# Altium project Bluetooth_Sentinel.PrjPcb
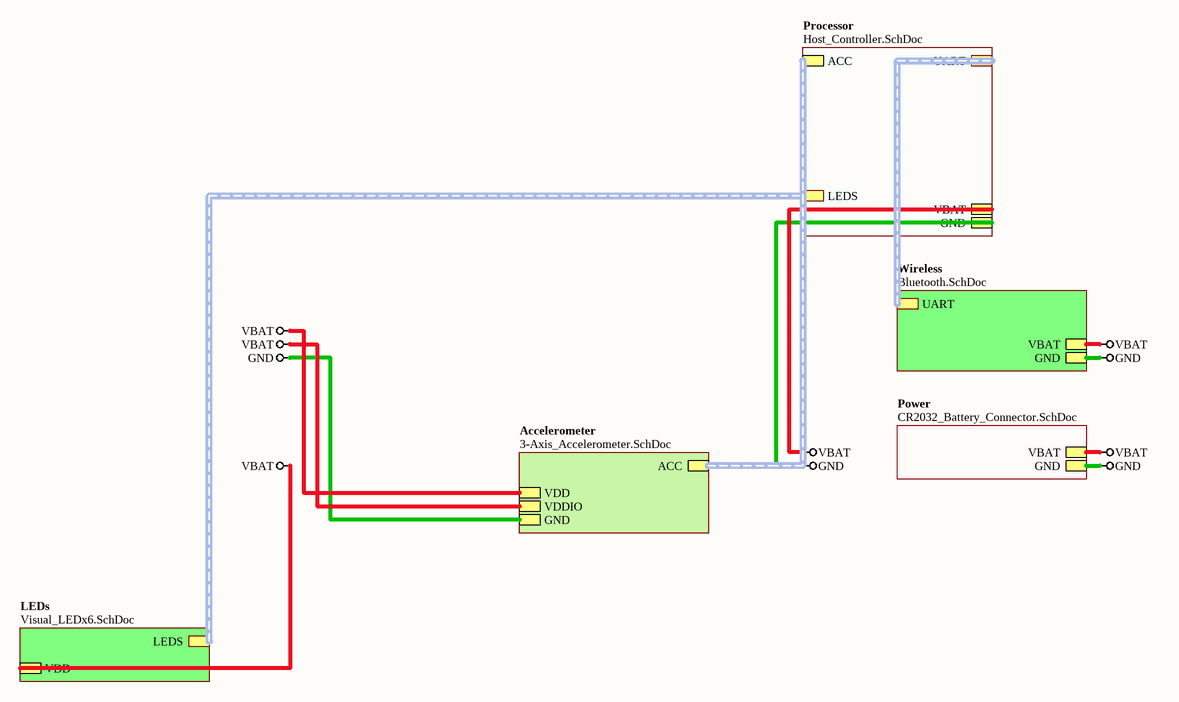
[diagram p0: Bluetooth_Sentinel.SchDoc]
2 sheets, 2 parts. Net scope: hierarchical (ports join the sheet entries above them; power ports are global).
Board file: Bluetooth_Sentinel.PcbDoc
Sheets:
  Bluetooth_Sentinel.SchDoc
  Sheet1.SchDoc

## Sheet Bluetooth_Sentinel.SchDoc: Bluetooth Sentinel
size A4

### Sub-sheets
Accelerometer = 3-Axis_Accelerometer.SchDoc (file not in this document): VDD, VDDIO, GND, ACC (harness SPI_LIS331)
LEDs = Visual_LEDx6.SchDoc (file not in this document): VDD, LEDS (harness LEDx6)
Power = CR2032_Battery_Connector.SchDoc (file not in this document): VBAT, GND
Processor = Host_Controller.SchDoc (file not in this document): UART (harness UART_HS), LEDS (harness LEDx6), VBAT, GND, ACC (harness SPI_LIS331)
Wireless = Bluetooth.SchDoc (file not in this document): UART (harness UART_HS), VBAT, GND

### Nets
GND: sheet Power/GND, sheet Wireless/GND, sheet Processor/GND, sheet Accelerometer/GND
VBAT: sheet Power/VBAT, sheet LEDs/VDD, sheet Wireless/VBAT, sheet Processor/VBAT, sheet Accelerometer/VDD, sheet Accelerometer/VDDIO

### Buses and harness runs
harness sheet Accelerometer/ACC = sheet LEDs/LEDS = sheet Processor/ACC = sheet Processor/LEDS
harness sheet Processor/UART = sheet Wireless/UART

### Notes on the sheet
- Sheet Title
- Project Title
- Size:
- Date:
- A4
- Item:
- Time:
- Revision:
- Sheet
- of
- File:

## Sheet Sheet1.SchDoc
size 558 x 431 mm
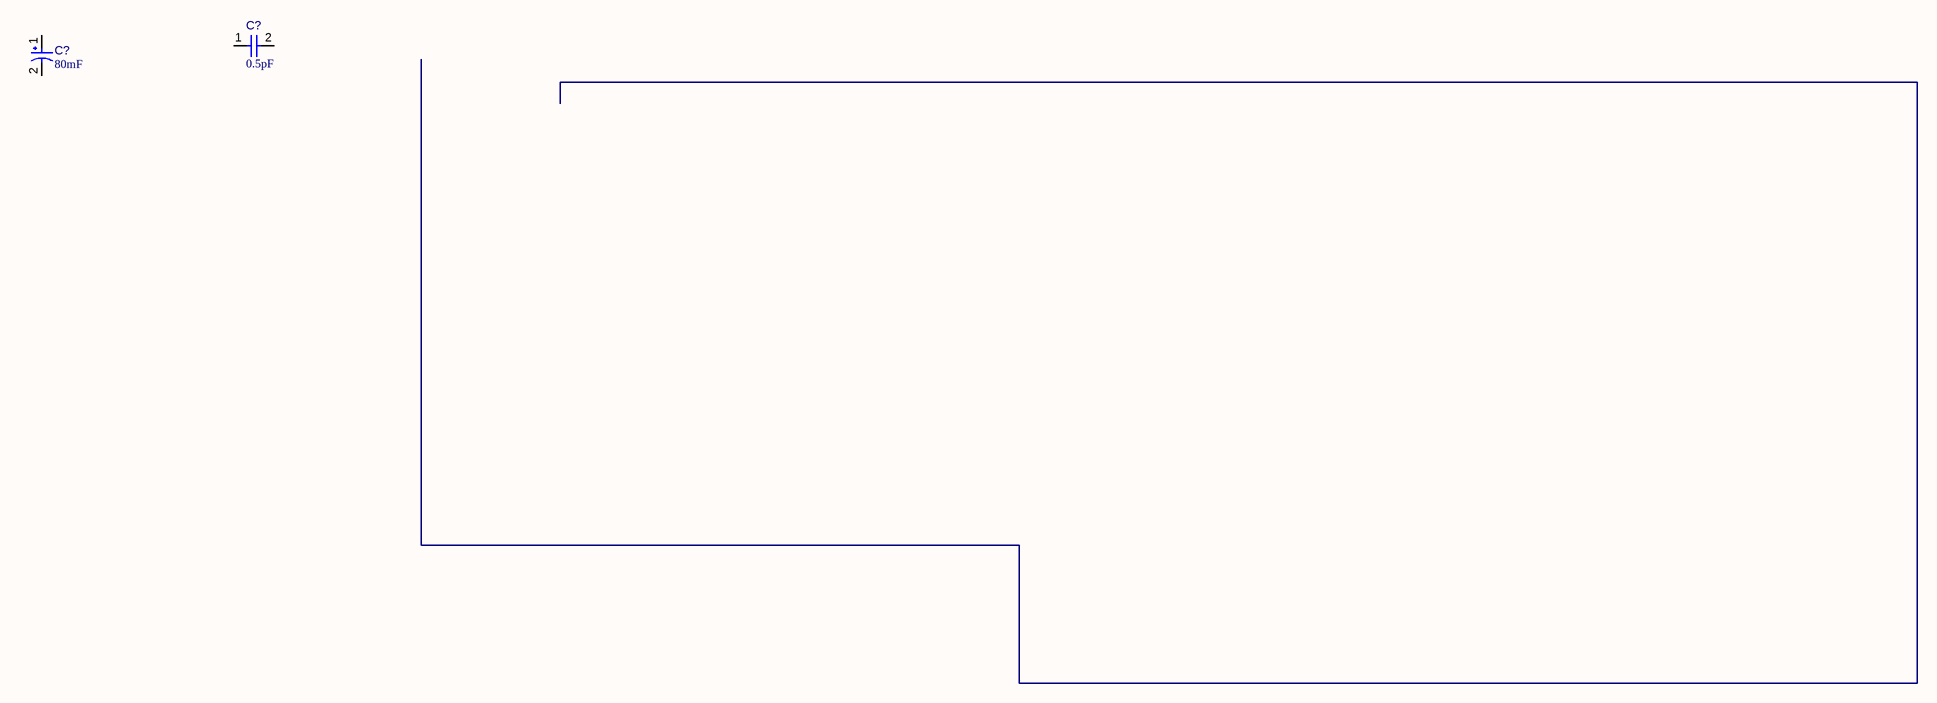
[diagram p1: Sheet1.SchDoc]

### Parts
(Parts that share a designator on the sheet are numbered #1, #2 ... from top to bottom, then left to right.)
C?#1  value 80mF  [SEIK-XH414HG-IV01E_V]  (hidden comment: XH414HG-IV01E)
C?#2  value 0.5pF  [CAPC1005X56X25ML10T15]  (hidden comment: Capacitor 0.5 pF +/- 0.1pF 25 V 0402)

### Nets

Not connected (* = marked no-connect by the designer): C?#1 1 2; C?#2 1 2

### Notes on the sheet
- 10
- 9
- 8
- 7
- 6
- 5
- 4
- 3
- DWG. NO.
- 2
- 1
- REV.
- SHT.
- REVISION
- DESCRIPTION
- DATE
- APPROVED
- H
- THIS DOCUMENT AND THE DATA DISCLOSED HEREIN OR HEREWITH IS THE PROPERTY OF ALTIUM LIMITED AND MAY BE FREELY DISTRIBUTED IN WHOLE. NO RIGHTS ARE RESERVED OR EXPRESS OR IMPLIED WARANTEE GIVEN.
- G
- F
- E
- D
- C
- B
- A
- TITLE
- SCALE:
- SIZE
- CAGE CODE
- FILE NAME
- DWG NO.
- SHEET
- OF
- REV

### Library data of the parts
C?#1 = CMP-001-00052-5: Electric Double Layer Capacitor, 80 mF, 3.3 V, -20 to 60 degC, RoHS; Manufacturer: Seiko Instruments; Voltage Rating: 3.3V; Capacitor Type: Electrolytic; Max Operating Temperature: 60°C; Package Reference: XH414HG-IV01E; RoHS Compliant: True; Datasheet Version: 39814; Mounting Technology: SM; Datasheet URL: http://media.digikey.com/pdf/Data%20Sheets/Seiko%20Instruments%20PDFs/XH414HG,%20XH409HG.pdf; Pins: 2; Manufacturer URL: http://www.sii.co.jp/en/; Package Description: 2-Pin Surface Mount Device, Diameter 4.8 mm; Case/Package: XH414HG-IV01E; Min Operating Temperature: -20°C
C?#2 = CMP-001-00002-4: Chip Capacitor, 0.5 pF, +/- 0.1pF, 25 V, 0402 (1005 Metric); Capacitor Type: Ceramic; Tolerance: 20%; Voltage Rating: 25V; Case/Package: 0402; Max Operating Temperature: 125°C; RoHS Compliant: True; Min Operating Temperature: -55°C; Mounting Technology: SM; Pins: 2